# EAGLE design MPR121-Breakout-v13 (EAGLE 7.2.0)
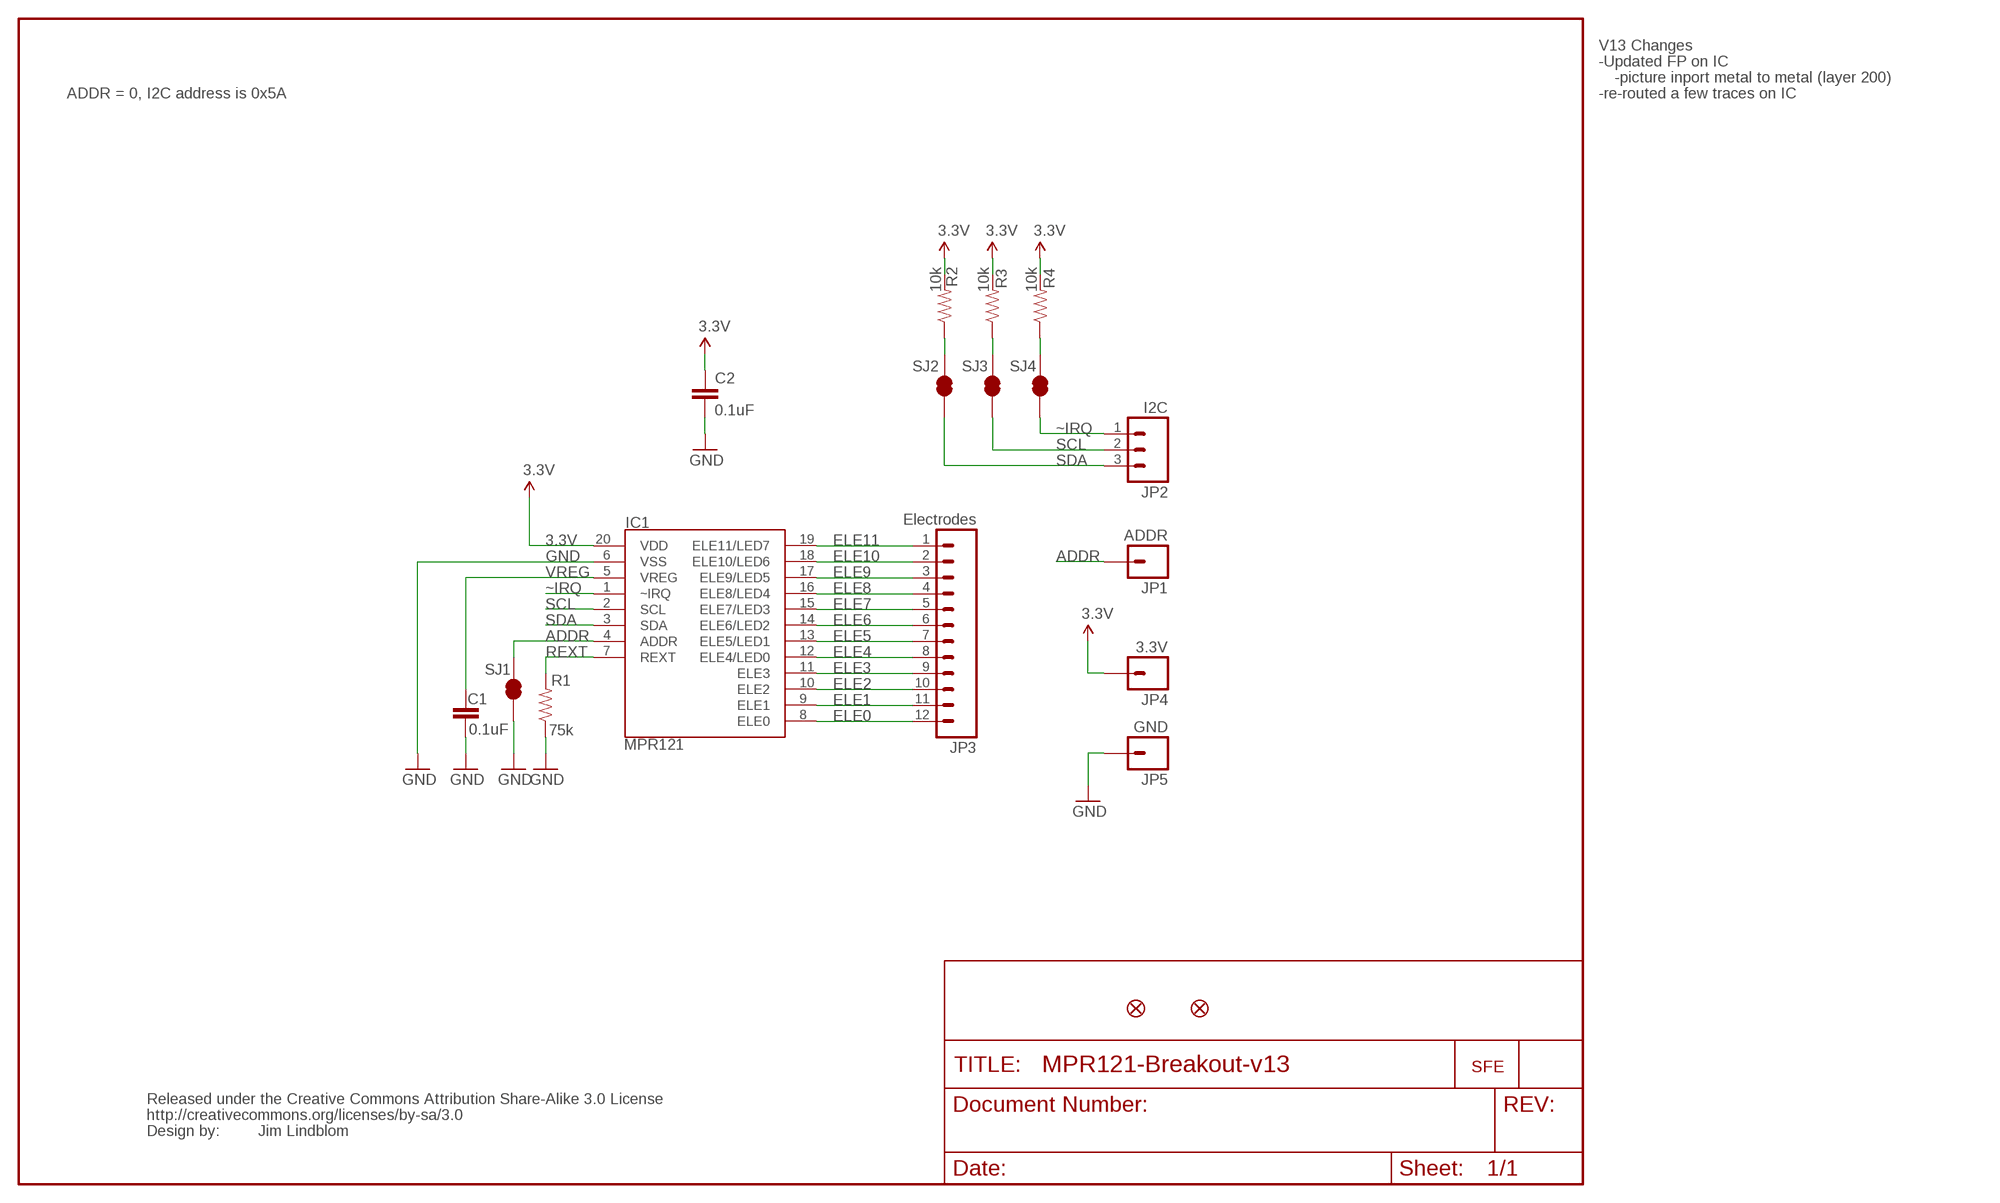
[diagram p0: schematic, sheet 1]

## Parts
C1  0.1uF  CAP0603-CAP  [0603-CAP]
C2  0.1uF  CAP0603-CAP  [0603-CAP]
IC1  MPR121  MPR121V2  [QFN-20-0.4MM-V2]
JP1  ADDR  M01PTH  [1X01]
JP2  I2C  M03PTH  [1X03]
JP3  Electrodes  M12PTH  [1X12]
JP4  3.3V  M01PTH  [1X01]
JP5  GND  M01PTH  [1X01]
JP7  LOGO-SFENEW  [SFE-NEW-WEBLOGO]
JP8  FIDUCIAL1X2  [FIDUCIAL-1X2]
JP9  FIDUCIAL1X2  [FIDUCIAL-1X2]
R1  75k  RESISTOR0603-RES  [0603-RES]
R2  10k  RESISTOR0603-RES  [0603-RES]
R3  10k  RESISTOR0603-RES  [0603-RES]
R4  10k  RESISTOR0603-RES  [0603-RES]
SJ1  SOLDERJUMPERTRACE  [SJ_2S-TRACE]
SJ2  SOLDERJUMPERTRACE  [SJ_2S-TRACE]
SJ3  SOLDERJUMPERTRACE  [SJ_2S-TRACE]
SJ4  SOLDERJUMPERTRACE  [SJ_2S-TRACE]
U$1  CREATIVE_COMMONS  [CREATIVE_COMMONS]

## Nets
3.3V: C2.1 IC1.20(VDD) JP4.1 R2.2 R3.2 R4.2
ADDR: IC1.4(ADDR) JP1.1 SJ1.2
ELE0: IC1.8(ELE0) JP3.12
ELE1: IC1.9(ELE1) JP3.11
ELE2: IC1.10(ELE2) JP3.10
ELE3: IC1.11(ELE3) JP3.9
ELE4: IC1.12(ELE4/LED0) JP3.8
ELE5: IC1.13(ELE5/LED1) JP3.7
ELE6: IC1.14(ELE6/LED2) JP3.6
ELE7: IC1.15(ELE7/LED3) JP3.5
ELE8: IC1.16(ELE8/LED4) JP3.4
ELE9: IC1.17(ELE9/LED5) JP3.3
ELE10: IC1.18(ELE10/LED6) JP3.2
ELE11: IC1.19(ELE11/LED7) JP3.1
GND: C1.2 C2.2 IC1.6(VSS) JP5.1 R1.1 SJ1.1
REXT: IC1.7(REXT) R1.2
SCL: IC1.2(SCL) JP2.2 SJ3.1
SCL_PU: R3.1 SJ3.2
SDA: IC1.3(SDA) JP2.3 SJ2.1
SDA_PU: R2.1 SJ2.2
VREG: C1.1 IC1.5(VREG)
~IRQ: IC1.1(~IRQ) JP2.1 SJ4.1
~IRQ_PU: R4.1 SJ4.2

## Notes on the sheet
- V13 Changes
- -Updated FP on IC
- -picture inport metal to metal (layer 200)
- ADDR = 0, I2C address is 0x5A | -re-routed a few traces on IC
- Jim Lindblom

## Library data of the parts
C1 C2 = SparkFun:CAP: Capacitor Standard 0603 ceramic capacitor, and 0.1" leaded capacitor.
IC1 = Testing:MPR121: MPR121 Capacitive Touch Sensor Controller. Variant "V2" was created using an image import of the bottom of the IC. It matches metal to metal.
JP1 JP4 JP5 = SparkFun:M01: Header 1 Standard 1-pin 0.1" header. Use with straight break away headers (SKU : PRT-00116), right angle break away headers (PRT-00553), swiss pins (PRT-00743), machine pins (PRT-00117), and female headers (PRT-00115).
JP2 = SparkFun:M03: Header 3 Standard 3-pin 0.1" header. Use with straight break away headers (SKU : PRT-00116), right angle break away headers (PRT-00553), swiss pins (PRT-00743), machine pins (PRT-00117), and female headers (PRT-00115). Molex polarized connector foot print use with SKU : PRT-08232 with associated crimp pins and housings.
JP3 = SparkFun:M12: Header 12 Standard 12-pin 0.1" header. Use with straight break away headers (SKU : PRT-00116), right angle break away headers (PRT-00553), swiss pins (PRT-00743), machine pins (PRT-00117), and female headers (PRT-00115).
JP7 = SparkFun:LOGO-SFE: Spark Fun Electronics PCB Logo This is the standard Spark Fun Electronics PCB logo.
JP8 JP9 = SparkFun:FIDUCIAL: Fiducial Alignment Points Various fiducial points for machine vision alignment.
R1-R4 = SparkFun:RESISTOR: Resistor Basic schematic elements and footprints for 0603, 1206, and PTH 1/10th watt (small) resistors.
SJ1-SJ4 = SparkFun:SOLDERJUMPER: Solder Jumper Standard SMD solder jumper. Used to automate production. Two varients : Normally Open and Normally Closed are the same, but have different paste layers. NC will have a large amount of paste and should jumper during reflow.
U$1 = SparkFun:CREATIVE_COMMONS

## Board
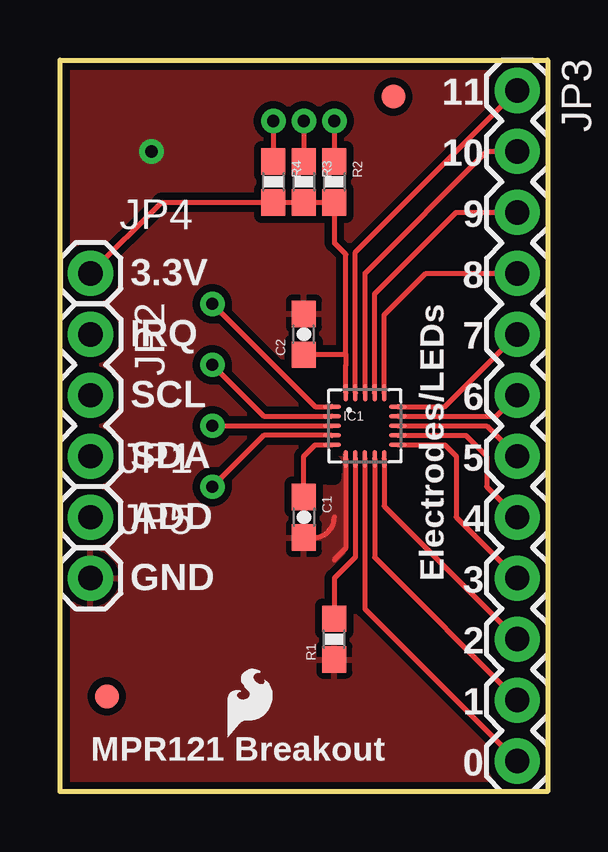
[diagram p1: board, top side]
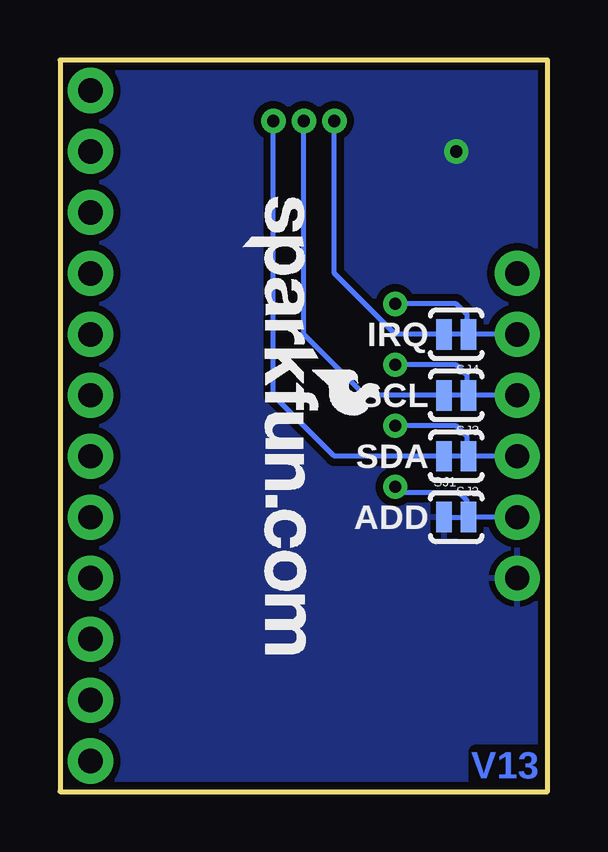
[diagram p2: board, bottom side, seen from below]

Size 20.32 x 30.48 mm. Coordinates in mm from the lower left corner, seen from the top.
Outline: 0,0 0,30.48 20.32,30.48 20.32,0 0,0
Copper layers (1*16): Top 0.035mm / dielectric 1.5mm / Bottom 0.035mm
Design rules "default": minimum track width 8mil, minimum drill 20mil, track to track 8mil, track to pad 8mil, pad to pad 8mil, via to via 8mil, smd to smd 8mil, copper to edge 8mil, drill to drill 8mil, minimum pad ring 12mil, minimum via ring 10mil, stop-mask expansion 4mil, vias tented up to drill 20mil, thermal gap 10mil
tRestrict: area 11.2,13.1 to 11.4,13.7

### Footprints (pad centres in the part's own frame; a part is rotated, then mirrored left to right if it is on the bottom)
0603-CAP = smd 1.1 x 1: 1 -0.85,0; 2 0.85,0
QFN-20-0.4MM-V2 = smd 0.75 x 0.195: 1 -1.367,0.8; 2 -1.367,0.4; 3 -1.367,0; 4 -1.367,-0.4; 5 -1.367,-0.8; 11 1.375,-0.8; 12 1.375,-0.4; 13 1.375,0; 14 1.375,0.4; 15 1.375,0.8 | smd 0.195 x 0.75: 6 -0.795,-1.372; 7 -0.395,-1.372; 8 0.005,-1.372; 9 0.405,-1.372; 10 0.805,-1.372; 16 0.81,1.372; 17 0.41,1.372; 18 0.01,1.372; 19 -0.39,1.372; 20 -0.79,1.372
1X01 = drill 1.016 pad 1.88: 1 0,0
1X03 = drill 1.016 pad 1.88: 1 0,0; 2 2.54,0; 3 5.08,0
1X12 = drill 1.016 pad 1.88: 1 0,0; 2 2.54,0; 3 5.08,0; 4 7.62,0; 5 10.16,0; 6 12.7,0; 7 15.24,0; 8 17.78,0; 9 20.32,0; 10 22.86,0; 11 25.4,0; 12 27.94,0
FIDUCIAL-1X2 = smd 1 x 1: 1 0,0
0603-RES = smd 1.1 x 1: 1 -0.85,0; 2 0.85,0
SJ_2S-TRACE = smd 0.635 x 1.27: 1 -0.508,0; 2 0.508,0

### Placement (x,y rotation side)
C1  10.16,11.43 270 top
C2  10.16,19.05 90 top
IC1  12.7,15.24 0 top
JP1  1.27,11.43 0 top
JP2  1.27,19.05 270 top
JP3  19.05,29.21 270 top
JP4  1.27,21.59 0 top
JP5  1.27,8.89 0 top
JP6  LOGO-SFESK  [SFE-LOGO-FLAME]  6.99,2.29 0 top
JP7  12.7,24.77 270 bottom
JP8  13.89,28.96 0 top
JP9  1.96,3.96 0 top
R1  11.43,6.35 90 top
R2  11.43,25.4 270 top
R3  10.16,25.4 270 top
R4  8.89,25.4 270 top
SJ1  3.81,11.43 0 bottom
SJ2  3.81,13.97 180 bottom
SJ3  3.81,16.51 180 bottom
SJ4  3.81,19.05 180 bottom
U$1  19.05,-8.89 0 top  (outside the outline)

### Tracks (layer width: path | path; a pad name or v marks a point on that pad's centre or on a via)
3.3V
  Top 0.203: JP4.1 4.23,24.55 R4.2 R3.2 R2.2 11.43,22.86 11.91,22.38 11.91,18.2 | 11.91,18.2 C2.1 | IC1.20 11.91,17.78 11.91,18.2
ADDR  (via drill 0.51)
  Top 0.203: IC1.4 8.49,14.84 v6.35,12.7
  Bottom 0.203: JP1.1 SJ1.2 3.36,12.12 3.68,12.45 6.1,12.45 v6.35,12.7
ELE0
  Top 0.203: IC1.8 12.71,7.62 JP3.12
ELE1
  Top 0.203: IC1.9 13.11,9.76 JP3.11
ELE2
  Top 0.203: IC1.10 13.51,11.89 JP3.10
ELE3
  Top 0.203: IC1.11 16.04,14.44 16.51,13.97 16.51,11.43 JP3.9
ELE4
  Top 0.203: IC1.12 16.91,14.84 17.78,13.97 17.78,12.7 JP3.8
ELE5
  Top 0.203: IC1.13 17.78,15.24 JP3.7
ELE6
  Top 0.203: IC1.14 18.18,15.64 JP3.6
ELE7
  Top 0.203: IC1.15 16.04,16.04 JP3.5
ELE8
  Top 0.203: IC1.16 13.51,19.86 15.24,21.59 JP3.4
ELE9
  Top 0.203: IC1.17 13.11,20.73 16.51,24.13 JP3.3
ELE10
  Top 0.203: IC1.18 12.71,21.6 17.78,26.67 JP3.2
ELE11
  Top 0.203: IC1.19 12.31,22.47 JP3.1
GND  (via drill 0.51)
  Top 0.203: IC1.6 11.9,10.13 11.43,9.65 | C1.2 10.58,10.58 arc90 11.43,11.43
  other vias: 3.81,26.67
  pour Top (isolate 0.305): 0,30.48 0,0 20.32,0 20.32,30.48
  pour Bottom (isolate 0.305): 0,30.48 0,0 20.32,0 20.32,30.48
REXT
  Top 0.203: IC1.7 12.3,9.77 11.43,8.89 R1.2
SCL  (via drill 0.51)
  Top 0.203: IC1.2 8.49,15.64 v6.35,17.78
  Bottom 0.203: JP2.2 SJ3.1 3.36,17.33 3.81,17.78 v6.35,17.78
SCL_PU  (via drill 0.51)
  Top 0.203: v10.16,27.94 R3.1
  Bottom 0.203: v10.16,27.94 10.16,19.05 7.62,16.51 SJ3.2
SDA  (via drill 0.51)
  Top 0.203: v6.35,15.24 IC1.3
  Bottom 0.203: JP2.3 SJ2.1 3.36,14.79 3.81,15.24 v6.35,15.24
SDA_PU  (via drill 0.51)
  Top 0.203: v11.43,27.94 R2.1
  Bottom 0.203: v11.43,27.94 11.43,16.51 8.89,13.97 SJ2.2
VREG
  Top 0.203: IC1.5 10.63,14.44 10.16,13.97 C1.1
~IRQ  (via drill 0.51)
  Top 0.203: IC1.1 10.63,16.04 v6.35,20.32
  Bottom 0.203: JP2.1 SJ4.1 3.36,19.87 3.81,20.32 v6.35,20.32
~IRQ_PU  (via drill 0.51)
  Top 0.203: v8.89,27.94 R4.1
  Bottom 0.203: v8.89,27.94 8.89,21.59 6.35,19.05 SJ4.2

### Text on the board
Bottom: V13
tPlace: 11 | 10 | 9 | 8 | 3.3V | 7 | IRQ | 6 | SCL | 5 | SDA | 4 | ADD | Electrodes/LEDs | 3 | GND | 2 | 1 | 0 | MPR121 Breakout
bPlace: IRQ | SCL | SDA | ADD
bOrigins: HI